# EAGLE schematic USBSolder (EAGLE 7.1.0)
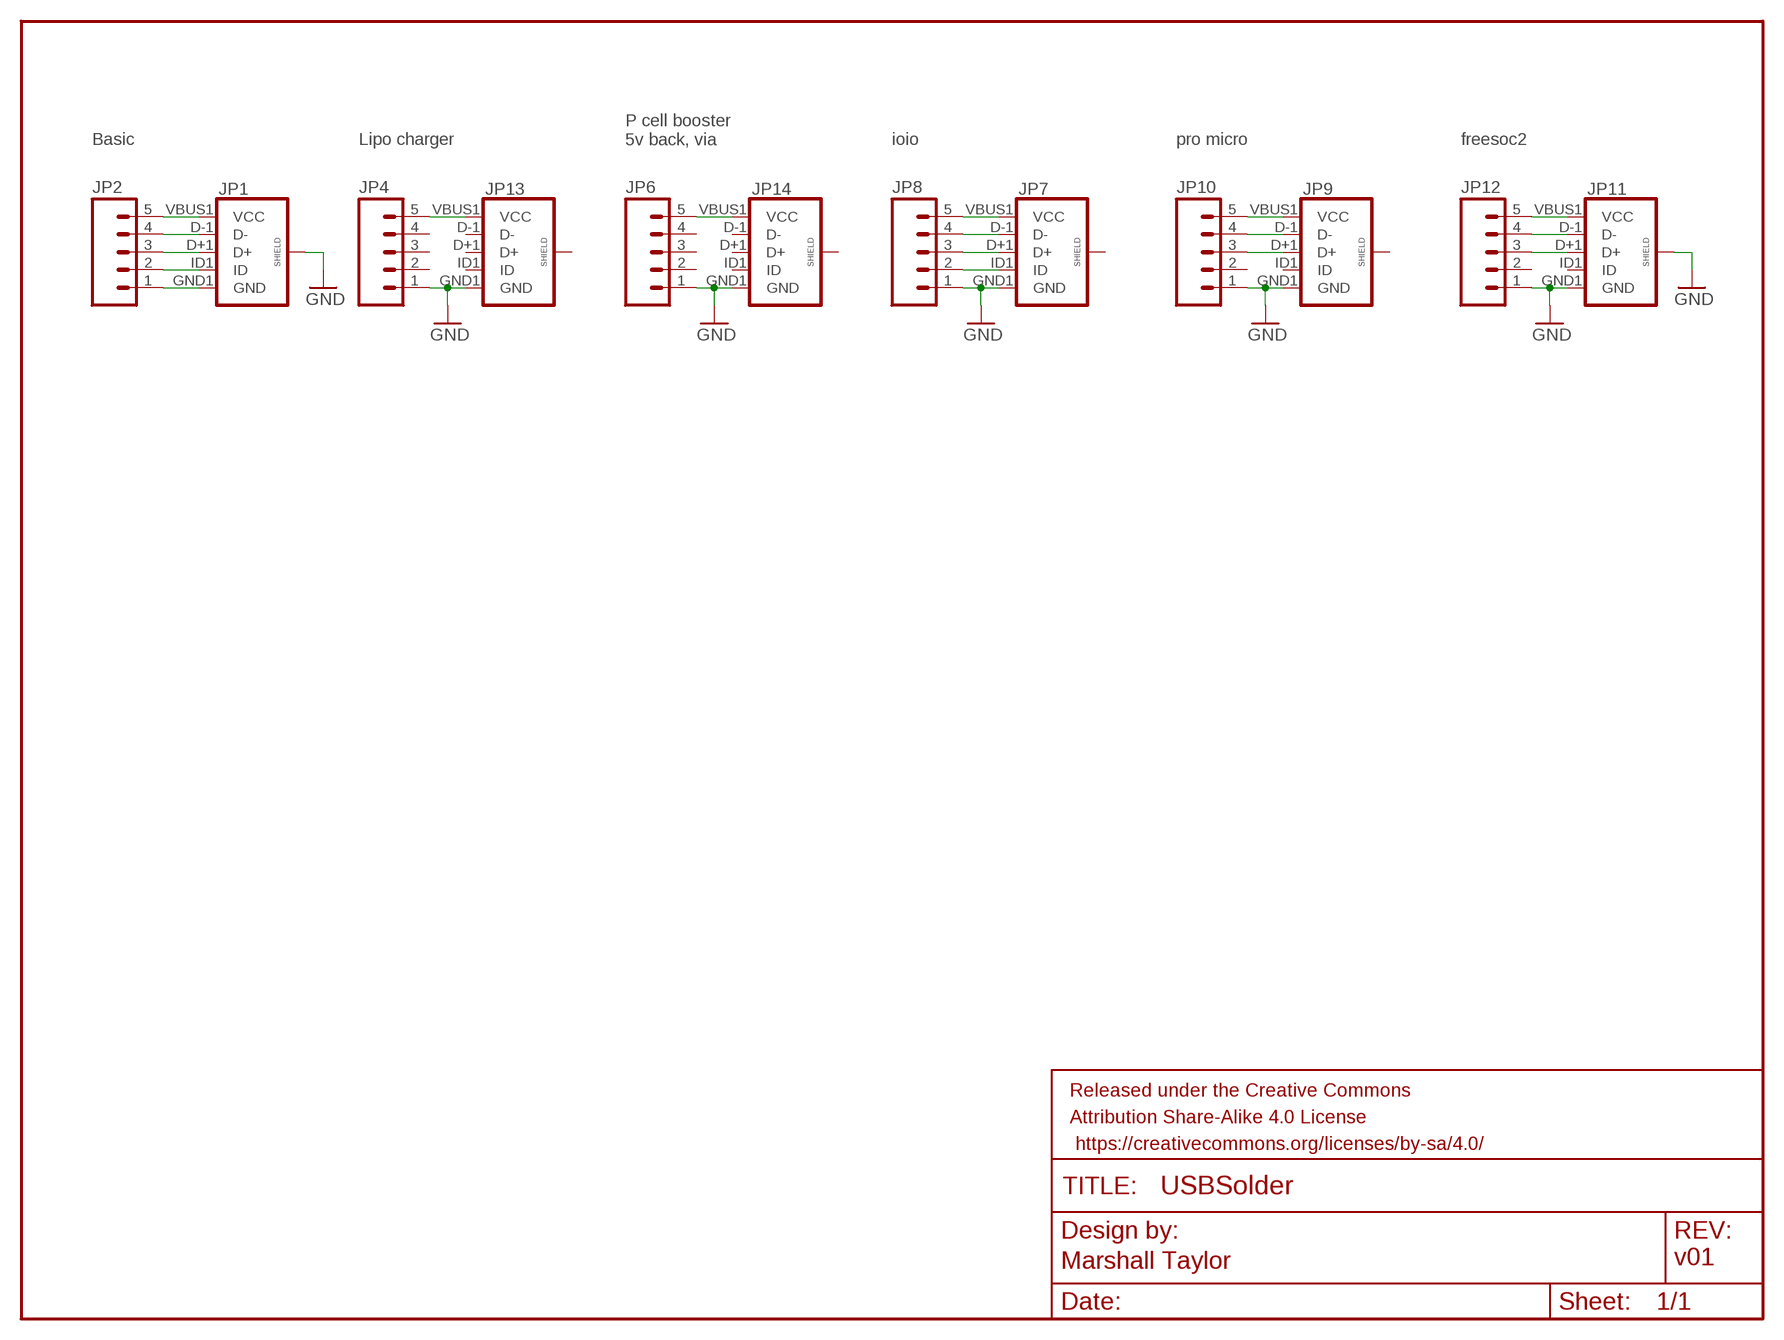
[diagram p0: schematic, sheet 1]

## Parts
FRAME1  FRAME-LETTER  [CREATIVE_COMMONS]
JP1  USB_MICROB_PLUGCONN-11752  [USB-B-MICRO-SMD_V03]
JP2  M05PTH  [1X05]
JP4  M05PTH  [1X05]
JP6  M05PTH  [1X05]
JP7  USB_MICROB_PLUGCONN-11752  [USB-B-MICRO-SMD_V03]
JP8  M05PTH  [1X05]
JP9  USB_MICROB_PLUGCONN-11752  [USB-B-MICRO-SMD_V03]
JP10  M05PTH  [1X05]
JP11  USB_MICROB_PLUGCONN-11752  [USB-B-MICRO-SMD_V03]
JP12  M05PTH  [1X05]
JP13  USB_MICROB_PLUGCONN-11752  [USB-B-MICRO-SMD_V03]
JP14  USB_MICROB_PLUGCONN-11752  [USB-B-MICRO-SMD_V03]

## Nets
5V1: JP6.5 JP14.VBUS1(VCC)
GND: JP1.SHIELD1(SHIELD) JP1.SHIELD2(SHIELD) JP1.SHIELD3(SHIELD) JP4.1 JP6.1 JP7.GND1(GND) JP8.1 JP9.GND1(GND) JP10.1 JP11.GND1(GND) JP11.SHIELD1(SHIELD) JP11.SHIELD2(SHIELD) JP11.SHIELD3(SHIELD) JP12.1 JP13.GND1(GND) JP14.GND1(GND)
N$1: JP1.GND1(GND) JP2.1
N$2: JP1.ID1(ID) JP2.2
N$3: JP1.D+1(D+) JP2.3
N$4: JP1.D-1(D-) JP2.4
N$5: JP1.VBUS1(VCC) JP2.5
N$9: JP7.ID1(ID) JP8.2
N$10: JP4.5 JP13.VBUS1(VCC)
N$11: JP7.D+1(D+) JP8.3
N$12: JP7.D-1(D-) JP8.4
N$13: JP7.VBUS1(VCC) JP8.5
N$16: JP9.D+1(D+) JP10.3
N$17: JP9.D-1(D-) JP10.4
N$18: JP9.VBUS1(VCC) JP10.5
N$21: JP11.D+1(D+) JP12.3
N$22: JP11.D-1(D-) JP12.4
N$23: JP11.VBUS1(VCC) JP12.5
Unconnected: JP4.2 JP4.3 JP4.4 JP6.2 JP6.3 JP6.4 JP7.SHIELD1(SHIELD) JP7.SHIELD2(SHIELD) JP7.SHIELD3(SHIELD) JP9.ID1(ID) JP9.SHIELD1(SHIELD) JP9.SHIELD2(SHIELD) JP9.SHIELD3(SHIELD) JP10.2 JP11.ID1(ID) JP12.2 JP13.D+1(D+) JP13.D-1(D-) JP13.ID1(ID) JP13.SHIELD1(SHIELD) JP13.SHIELD2(SHIELD) JP13.SHIELD3(SHIELD) JP14.D+1(D+) JP14.D-1(D-) JP14.ID1(ID) JP14.SHIELD1(SHIELD) JP14.SHIELD2(SHIELD) JP14.SHIELD3(SHIELD)

## Notes on the sheet
- Basic | Lipo charger
- P cell booster
  5v back, via
- ioio | pro micro | freesoc2
- Marshall Taylor | v01

## Library data of the parts
FRAME1 = SparkFun-Aesthetics:FRAME-LETTER: Schematic Frame Standard 8.5x11 US Letter frame
JP1 JP7 JP9 JP11 JP13 JP14 = TestUSBs:USB_MICROB_PLUG: USB Micro-B connectors Some male, some female. Watch your step!; PROD_ID: CONN-11752
JP2 JP4 JP6 JP8 JP10 JP12 = SparkFun-Connectors:M05: Header 5 Standard 5-pin 0.1" header. Use with straight break away headers (SKU : PRT-00116), right angle break away headers (PRT-00553), swiss pins (PRT-00743), machine pins (PRT-00117), and female headers (PRT-00115). Molex polarized connector foot print use with SKU : PRT-08230 with associated crimp pins and housings.